# Altium schematic sheet TOP LAYER.SchDoc
size A
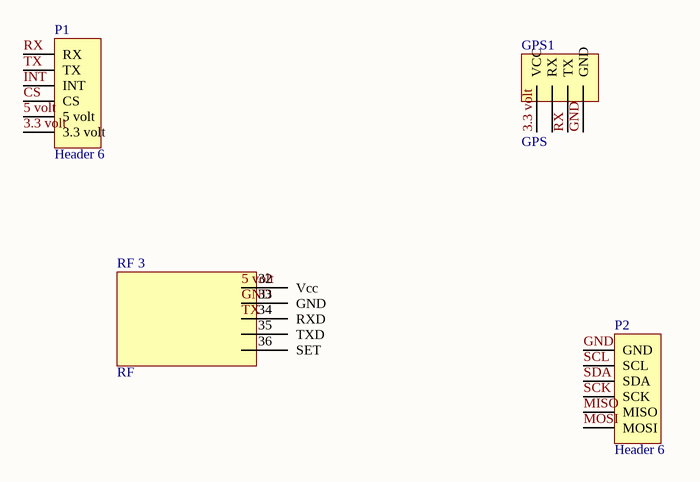
[diagram p0: TOP LAYER.SchDoc]

## Parts
GPS1  GPS  [GPS]
P1  Header 6  [HDR1X6]
P2  Header 6  [HDR1X6]
RF_3  RF  [RF]

## Nets
3.3 volt: GPS1.12(VCC) P1.6(3.3_volt)
5 volt: P1.5(5_volt) RF_3.32(Vcc)
CS: P1.4(CS)
GND: GPS1.15(GND) P2.1(GND) RF_3.33(GND)
INT: P1.3(INT)
MISO: P2.5(MISO)
MOSI: P2.6(MOSI)
RX: GPS1.14(TX) P1.1(RX)
SCK: P2.4(SCK)
SCL: P2.2(SCL)
SDA: P2.3(SDA)
TX: P1.2(TX) RF_3.34(RXD)

Not connected (* = marked no-connect by the designer): GPS1 13(RX); RF_3 35(TXD) 36(SET)

## Library data of the parts
P1 P2 = Header 6: Header, 6-Pin; LatestRevisionDate: 17-Jul-2002; LatestRevisionNote: Re-released for DXP Platform.; Publisher: Altium Limited